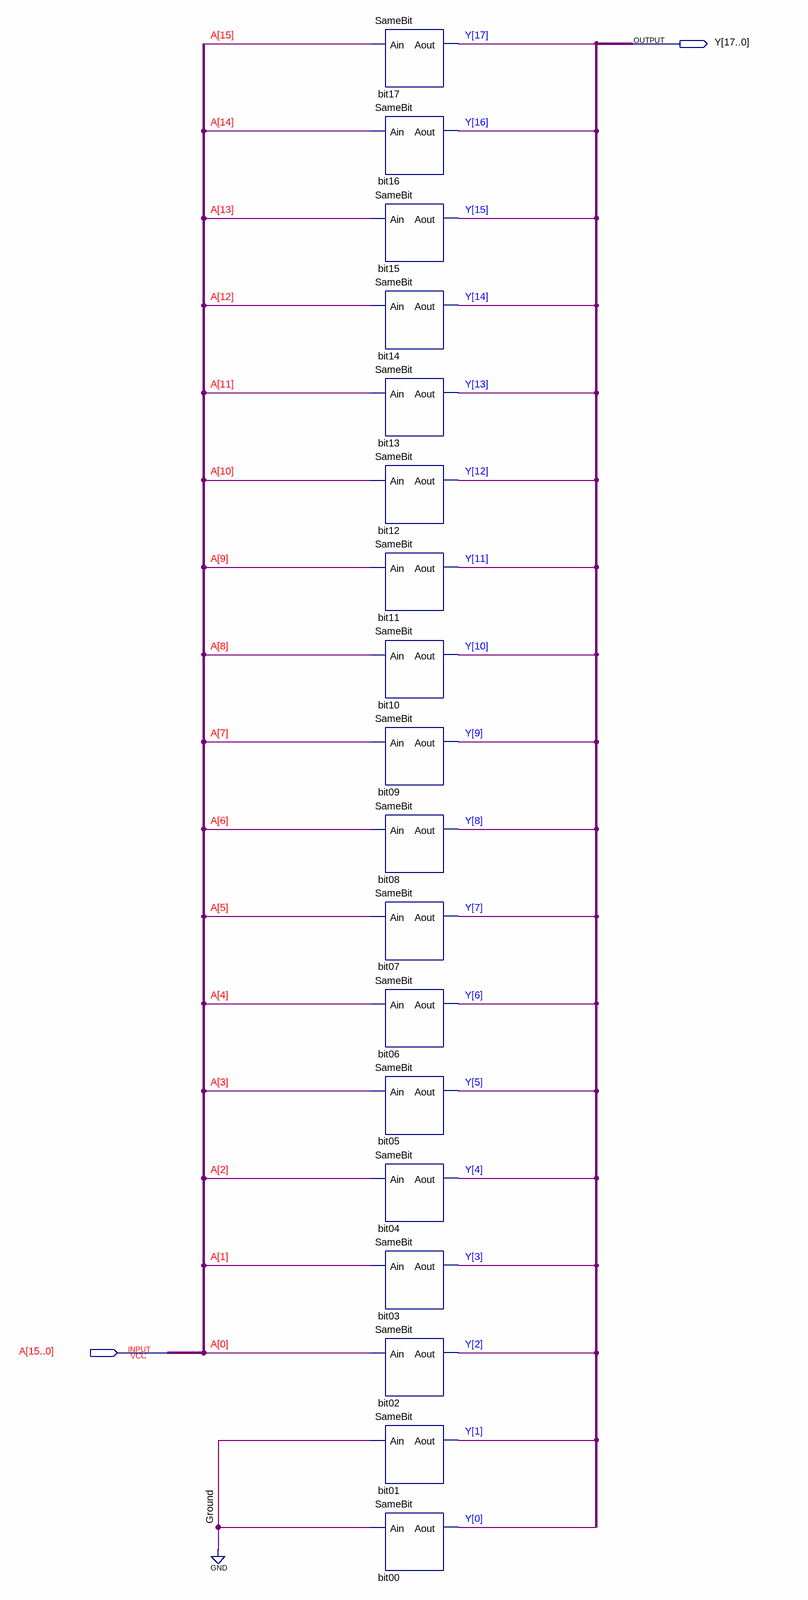
[diagram p0: schematic sheet]
// Quartus schematic SL2_16.bdf as structural Verilog: 18 symbols, 2 pins
module SL2_16 (
  input  [15:0] A,
  output [17:0] Y
);

  SameBit bit17 (.Ain(A[15]), .Aout(Y[17]));
  SameBit bit16 (.Ain(A[14]), .Aout(Y[16]));
  SameBit bit15 (.Ain(A[13]), .Aout(Y[15]));
  SameBit bit14 (.Ain(A[12]), .Aout(Y[14]));
  SameBit bit13 (.Ain(A[11]), .Aout(Y[13]));
  SameBit bit12 (.Ain(A[10]), .Aout(Y[12]));
  SameBit bit11 (.Ain(A[9]), .Aout(Y[11]));
  SameBit bit10 (.Ain(A[8]), .Aout(Y[10]));
  SameBit bit09 (.Ain(A[7]), .Aout(Y[9]));
  SameBit bit08 (.Ain(A[6]), .Aout(Y[8]));
  SameBit bit07 (.Ain(A[5]), .Aout(Y[7]));
  SameBit bit06 (.Ain(A[4]), .Aout(Y[6]));
  SameBit bit05 (.Ain(A[3]), .Aout(Y[5]));
  SameBit bit04 (.Ain(A[2]), .Aout(Y[4]));
  SameBit bit03 (.Ain(A[1]), .Aout(Y[3]));
  SameBit bit02 (.Ain(A[0]), .Aout(Y[2]));
  SameBit bit01 (.Ain(1'b0), .Aout(Y[1]));
  SameBit bit00 (.Ain(1'b0), .Aout(Y[0]));
endmodule
